# Altium project Thermostat.PrjPCB (part 1 of 4)
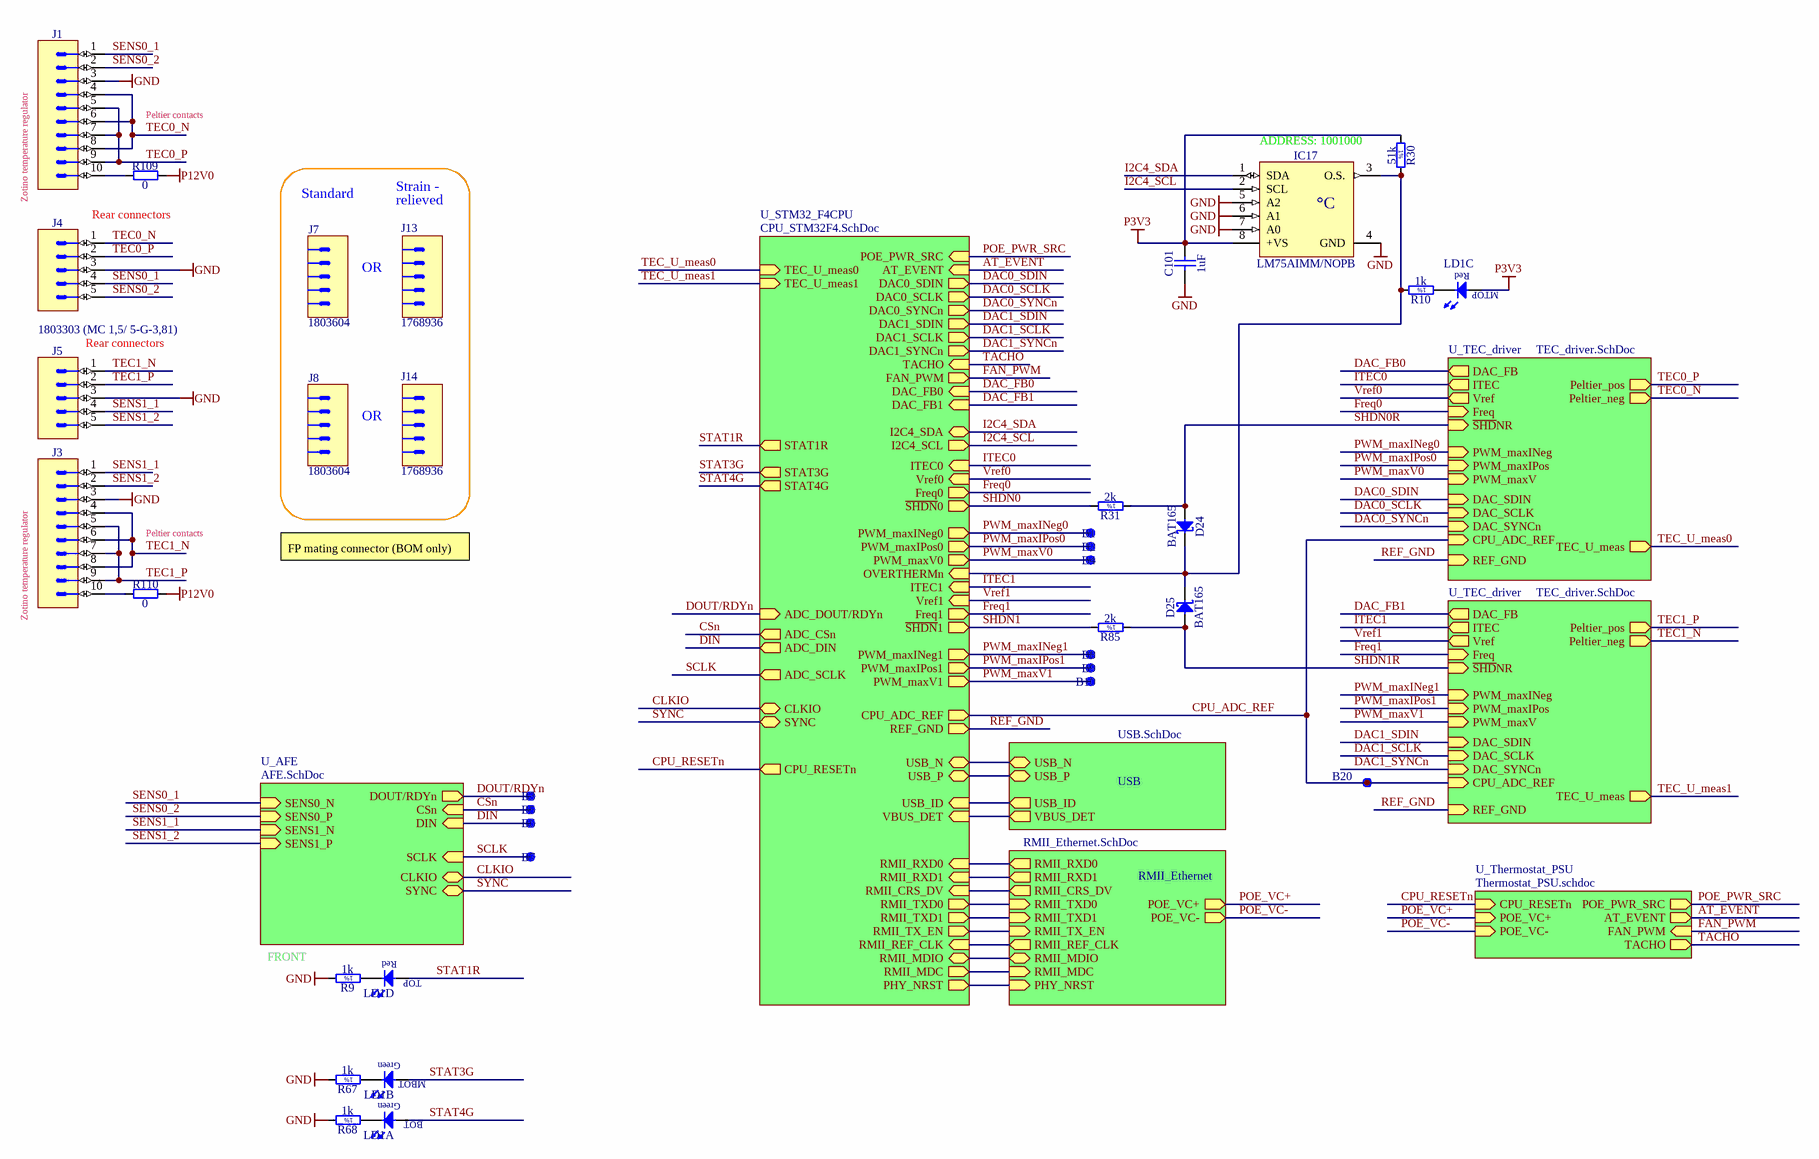
[diagram p0: Thermostat.schdoc]
P_version: 2.2.4
7 sheets, 417 parts. Net scope: hierarchical (ports join the sheet entries above them; power ports are global).
Board file: Thermostat.PCBDOC
Sheets:
  Thermostat.schdoc
    U_STM32_F4CPU = CPU_STM32F4.SchDoc
    U_AFE = AFE.SchDoc
    U_TEC_driver = TEC_driver.SchDoc
    U_TEC_driver = TEC_driver.SchDoc
    RMII_Ethernet = RMII_Ethernet.SchDoc
    USB = USB.SchDoc
    U_Thermostat_PSU = Thermostat_PSU.schdoc

## Sheet Thermostat.schdoc: Thermostat
size 420 x 297 mm; EDA_Number: ARTIQ; Projet: Thermostat; CheckedBy: -; Author: G.Kasprowicz; CompanyName: WUT ISE; DrawnBy: G.Kasprowicz; Organization: WUT ISE; Address1: PW ISE; Address2: Nowowiejska 15/19 00-665 Warsaw; Address3: gkasprow@gmail.com; DocumentNumber: 1; Revision: 2.2.4; SheetNumber: 1; SheetTotal: 6; ModifiedBy: -; CreateDate: -; CheckedDate: -; Title2: Top; DivGrp: WUT ISE; Designer: G.Kasprowicz; ModifiedDate: -; ProjectName: Sensor Box

### Parts
B1  SMD Pad  [C100]  (value not drawn)  (no BOM)
B2  SMD Pad  [C100]  (value not drawn)  (no BOM)
B3  SMD Pad  [C100]  (value not drawn)  (no BOM)
B4  SMD Pad  [C100]  (value not drawn)  (no BOM)
B5  SMD Pad  [C100]  (value not drawn)  (no BOM)
B6  SMD Pad  [C100]  (value not drawn)  (no BOM)
B7  SMD Pad  [C100]  (value not drawn)  (no BOM)
B8  SMD Pad  [C100]  (value not drawn)  (no BOM)
B9  SMD Pad  [C100]  (value not drawn)  (no BOM)
B10  SMD Pad  [C100]  (value not drawn)  (no BOM)
B20  SMD Pad  [C100]  (value not drawn)  (no BOM)
C101  1uF  [CAPC1608X87N]
D24  BAT165  [SOD2512X110N]
D25  BAT165  [SOD2512X110N]
IC17  LM75AIMM/NOPB  [SOP65P490X109-8N]
J1  Header 10  [3M_N2510-6002RB]  (value not drawn)
J3  Header 10  [3M_N2510-6002RB]  (value not drawn)
J4  PHOENIX_1803303  [PHOENIX_1803303]  (value not drawn)
J5  Manufacturer Part Number: 1803303 (MC 1,5/ 5-G-3,81)  [PHOENIX_1803303]  (hidden comment: PHOENIX_1803303)
J7  1803604  [PHOENIX_1803604]
J8  1803604  [PHOENIX_1803604]
J13  1768936  [PHOENIX_1768936]
J14  1768936  [PHOENIX_1768936]
LD1  Green/Green/HeRed/HeRed  [LED_BIVAR_H485CHHGGDL]  (value not drawn)  (parts A,B,C,D of 4)
R9  1k  [RESC1005X40N]
R10  1k  [RESC1005X40N]
R30  51k  [RESC1005X40N]
R31  2k  [RESC1005X40N]
R67  1k  [RESC1005X40N]
R68  1k  [RESC1005X40N]
R85  2k  [RESC1005X40N]
R109  0  [RESC1608X55N]
R110  0  [RESC1608X55N]

### Sub-sheets
RMII_Ethernet = RMII_Ethernet.SchDoc: RMII_TXD0 (in), RMII_TX_EN (in), RMII_RXD0 (out), RMII_REF_CLK (out), RMII_CRS_DV (out), RMII_MDC (in), RMII_MDIO (bidir), PHY_NRST (in), RMII_TXD1 (in), RMII_RXD1 (out), POE_VC+ (out), POE_VC- (out)
U_AFE = AFE.SchDoc: SCLK (in), DOUT/RDYn (out), SENS1_P (in), SENS1_N (in), SENS0_N (in), SENS0_P (in), CSn (in), DIN (in), CLKIO (bidir), SYNC (bidir)
U_STM32_F4CPU = CPU_STM32F4.SchDoc: STAT1R (out), OVERTHERMn (in), ITEC0 (in), Vref0 (in), Freq0 (out), ~{SHDN}0 (out), PWM_maxINeg0 (out), PWM_maxIPos0 (out), PWM_maxV0 (out), ITEC1 (in), Freq1 (out), ~{SHDN}1 (out), PWM_maxINeg1 (out), PWM_maxIPos1 (out), PWM_maxV1 (out), Vref1 (in), ADC_SCLK (out), ADC_DOUT/RDYn (in), ADC_CSn (out), ADC_DIN (out), USB_ID (in), RMII_RXD0 (in), USB_N (bidir), USB_P (bidir), RMII_TXD0 (out), RMII_RXD1 (in), RMII_MDC (out), RMII_TXD1 (out), RMII_TX_EN (out), RMII_CRS_DV (in), RMII_REF_CLK (in), RMII_MDIO (bidir), DAC0_SDIN (out), DAC0_SCLK (out), DAC0_SYNCn (out), DAC1_SDIN (out), DAC1_SCLK (out), DAC1_SYNCn (out), DAC_FB0 (in), DAC_FB1 (in), AT_EVENT (in), STAT3G (out), STAT4G (out), CLKIO (bidir), SYNC (bidir), TEC_U_meas0 (in), TEC_U_meas1 (in), CPU_RESETn (out), PHY_NRST (out), I2C4_SDA (bidir), I2C4_SCL (out), TACHO (in), CPU_ADC_REF (out), POE_PWR_SRC (in), REF_GND (out), FAN_PWM (out), VBUS_DET (in)
U_TEC_driver = TEC_driver.SchDoc: Peltier_pos (out), Peltier_neg (out), Freq (in), ~{SHD}NR (in), ITEC (out), Vref (out), PWM_maxINeg (in), PWM_maxIPos (in), PWM_maxV (in), DAC_SDIN (in), DAC_SYNCn (in), DAC_SCLK (in), DAC_FB (out), TEC_U_meas (out), REF_GND (in), CPU_ADC_REF (in)
U_TEC_driver = TEC_driver.SchDoc: Peltier_pos (out), Peltier_neg (out), Freq (in), ~{SHD}NR (in), ITEC (out), Vref (out), PWM_maxINeg (in), PWM_maxIPos (in), PWM_maxV (in), DAC_SDIN (in), DAC_SYNCn (in), DAC_SCLK (in), DAC_FB (out), TEC_U_meas (out), REF_GND (in), CPU_ADC_REF (in)
U_Thermostat_PSU = Thermostat_PSU.schdoc: CPU_RESETn (in), POE_VC+ (in), POE_VC- (in), POE_PWR_SRC (out), AT_EVENT (out), TACHO (out), FAN_PWM (in)
USB = USB.SchDoc: VBUS_DET (out), USB_N (bidir), USB_P (bidir), USB_ID (out)

### Nets
GND: C101.1 IC17.4(GND) IC17.5(A2) IC17.6(A1) IC17.7(A0) J1.3 J3.3 J4.3 J5.3 R9.2 R67.2 R68.2
P3V3: C101.2 IC17.8(+VS) LD1.6(A) R30.1
P12V0: R109.2 R110.2
~{SHDN}0: R31.2 ; sheet U_STM32_F4CPU/~{SHDN}0
~{SHDN}0R: D24.2(A) R31.1 ; sheet U_TEC_driver/~{SHD}NR
~{SHDN}1: R85.2 ; sheet U_STM32_F4CPU/~{SHDN}1
~{SHDN}1R: D25.2(A) R85.1 ; sheet U_TEC_driver/~{SHD}NR
AT_EVENT: sheet U_STM32_F4CPU/AT_EVENT, sheet U_Thermostat_PSU/AT_EVENT
CLKIO: sheet U_STM32_F4CPU/CLKIO, sheet U_AFE/CLKIO
CPU_ADC_REF: B20.1 ; sheet U_STM32_F4CPU/CPU_ADC_REF, sheet U_TEC_driver/CPU_ADC_REF, sheet U_TEC_driver/CPU_ADC_REF
CPU_RESETn: sheet U_STM32_F4CPU/CPU_RESETn, sheet U_Thermostat_PSU/CPU_RESETn
CSn: B5.1 ; sheet U_STM32_F4CPU/ADC_CSn, sheet U_AFE/CSn  [project net ADC_CSn]
DAC0_SCLK: sheet U_STM32_F4CPU/DAC0_SCLK, sheet U_TEC_driver/DAC_SCLK
DAC0_SDIN: sheet U_STM32_F4CPU/DAC0_SDIN, sheet U_TEC_driver/DAC_SDIN
DAC0_SYNCn: sheet U_STM32_F4CPU/DAC0_SYNCn, sheet U_TEC_driver/DAC_SYNCn
DAC1_SCLK: sheet U_STM32_F4CPU/DAC1_SCLK, sheet U_TEC_driver/DAC_SCLK
DAC1_SDIN: sheet U_STM32_F4CPU/DAC1_SDIN, sheet U_TEC_driver/DAC_SDIN
DAC1_SYNCn: sheet U_STM32_F4CPU/DAC1_SYNCn, sheet U_TEC_driver/DAC_SYNCn
DAC_FB0: sheet U_STM32_F4CPU/DAC_FB0, sheet U_TEC_driver/DAC_FB
DAC_FB1: sheet U_STM32_F4CPU/DAC_FB1, sheet U_TEC_driver/DAC_FB
DIN: B6.1 ; sheet U_STM32_F4CPU/ADC_DIN, sheet U_AFE/DIN  [project net ADC_DIN]
DOUT/RDYn: B3.1 ; sheet U_STM32_F4CPU/ADC_DOUT/RDYn, sheet U_AFE/DOUT/RDYn  [project net ADC_DOUT/RDYn]
FAN_PWM: sheet U_STM32_F4CPU/FAN_PWM, sheet U_Thermostat_PSU/FAN_PWM
Freq0: sheet U_STM32_F4CPU/Freq0, sheet U_TEC_driver/Freq
Freq1: sheet U_STM32_F4CPU/Freq1, sheet U_TEC_driver/Freq
I2C4_SCL: IC17.2(SCL) ; sheet U_STM32_F4CPU/I2C4_SCL
I2C4_SDA: IC17.1(SDA) ; sheet U_STM32_F4CPU/I2C4_SDA
ITEC0: sheet U_STM32_F4CPU/ITEC0, sheet U_TEC_driver/ITEC
ITEC1: sheet U_STM32_F4CPU/ITEC1, sheet U_TEC_driver/ITEC
NRST: sheet U_STM32_F4CPU/PHY_NRST, sheet RMII_Ethernet/PHY_NRST
OVERTHERMn: D24.1(C) D25.1(C) IC17.3(O.S.) R10.2 R30.2 ; sheet U_STM32_F4CPU/OVERTHERMn
POE_PWR_SRC: sheet U_STM32_F4CPU/POE_PWR_SRC, sheet U_Thermostat_PSU/POE_PWR_SRC
POE_VC+: sheet RMII_Ethernet/POE_VC+, sheet U_Thermostat_PSU/POE_VC+
POE_VC-: sheet RMII_Ethernet/POE_VC-, sheet U_Thermostat_PSU/POE_VC-
PWM_maxINeg0: B1.1 ; sheet U_STM32_F4CPU/PWM_maxINeg0, sheet U_TEC_driver/PWM_maxINeg
PWM_maxINeg1: B8.1 ; sheet U_STM32_F4CPU/PWM_maxINeg1, sheet U_TEC_driver/PWM_maxINeg
PWM_maxIPos0: B2.1 ; sheet U_STM32_F4CPU/PWM_maxIPos0, sheet U_TEC_driver/PWM_maxIPos
PWM_maxIPos1: B9.1 ; sheet U_STM32_F4CPU/PWM_maxIPos1, sheet U_TEC_driver/PWM_maxIPos
PWM_maxV0: B4.1 ; sheet U_STM32_F4CPU/PWM_maxV0, sheet U_TEC_driver/PWM_maxV
PWM_maxV1: B10.1 ; sheet U_STM32_F4CPU/PWM_maxV1, sheet U_TEC_driver/PWM_maxV
REF_GND: sheet U_STM32_F4CPU/REF_GND, sheet U_TEC_driver/REF_GND, sheet U_TEC_driver/REF_GND
RMII_CRS_DV: sheet U_STM32_F4CPU/RMII_CRS_DV, sheet RMII_Ethernet/RMII_CRS_DV
RMII_MDC: sheet U_STM32_F4CPU/RMII_MDC, sheet RMII_Ethernet/RMII_MDC
RMII_MDIO: sheet U_STM32_F4CPU/RMII_MDIO, sheet RMII_Ethernet/RMII_MDIO
RMII_REF_CLK: sheet U_STM32_F4CPU/RMII_REF_CLK, sheet RMII_Ethernet/RMII_REF_CLK
RMII_RXD0: sheet U_STM32_F4CPU/RMII_RXD0, sheet RMII_Ethernet/RMII_RXD0
RMII_RXD1: sheet U_STM32_F4CPU/RMII_RXD1, sheet RMII_Ethernet/RMII_RXD1
RMII_TX_EN: sheet U_STM32_F4CPU/RMII_TX_EN, sheet RMII_Ethernet/RMII_TX_EN
RMII_TXD0: sheet U_STM32_F4CPU/RMII_TXD0, sheet RMII_Ethernet/RMII_TXD0
RMII_TXD1: sheet U_STM32_F4CPU/RMII_TXD1, sheet RMII_Ethernet/RMII_TXD1
SCLK: B7.1 ; sheet U_STM32_F4CPU/ADC_SCLK, sheet U_AFE/SCLK  [project net ADC_SCLK]
SENS0_1: J1.1 J4.4 ; sheet U_AFE/SENS0_N
SENS0_2: J1.2 J4.5 ; sheet U_AFE/SENS0_P
SENS1_1: J3.1 J5.4 ; sheet U_AFE/SENS1_N
SENS1_2: J3.2 J5.5 ; sheet U_AFE/SENS1_P
STAT1R: LD1.8(A) ; sheet U_STM32_F4CPU/STAT1R
STAT3G: LD1.4(A) ; sheet U_STM32_F4CPU/STAT3G
STAT4G: LD1.2(A) ; sheet U_STM32_F4CPU/STAT4G
SYNC: sheet U_STM32_F4CPU/SYNC, sheet U_AFE/SYNC
TACHO: sheet U_STM32_F4CPU/TACHO, sheet U_Thermostat_PSU/TACHO
TEC0_N: J1.4 J1.6 J1.8 J4.1 ; sheet U_TEC_driver/Peltier_neg
TEC0_P: J1.5 J1.7 J1.9 J4.2 ; sheet U_TEC_driver/Peltier_pos
TEC1_N: J3.4 J3.6 J3.8 J5.1 ; sheet U_TEC_driver/Peltier_neg
TEC1_P: J3.5 J3.7 J3.9 J5.2 ; sheet U_TEC_driver/Peltier_pos
TEC_U_meas0: sheet U_STM32_F4CPU/TEC_U_meas0, sheet U_TEC_driver/TEC_U_meas  [project net ADC3_IN12]
TEC_U_meas1: sheet U_STM32_F4CPU/TEC_U_meas1, sheet U_TEC_driver/TEC_U_meas  [project net ADC3_IN13]
USB_ID: sheet U_STM32_F4CPU/USB_ID, sheet USB/USB_ID
USB_N: sheet U_STM32_F4CPU/USB_N, sheet USB/USB_N
USB_P: sheet U_STM32_F4CPU/USB_P, sheet USB/USB_P
USB_VBUS: sheet U_STM32_F4CPU/VBUS_DET, sheet USB/VBUS_DET
Vref0: sheet U_STM32_F4CPU/Vref0, sheet U_TEC_driver/Vref
Vref1: sheet U_STM32_F4CPU/Vref1, sheet U_TEC_driver/Vref
NetJ1_10: J1.10 R109.1
NetJ3_10: J3.10 R110.1
NetLD1_1: LD1.1(C) R68.1
NetLD1_3: LD1.3(C) R67.1
NetLD1_5: LD1.5(C) R10.1
NetLD1_7: LD1.7(C) R9.1

### Notes on the sheet
- Peltier contacts
- (near J13) Strain -
- ADDRESS: 1001000
- Zotino temperature regulator
- Rear connectors
- Standard
- (near J13) relieved
- (near J13) OR
- (near J5) Rear connectors
- (near J14) OR
- FP mating connector (BOM only)
- (near J3) Zotino temperature regulator
- (near R9) FRONT
- Project/Equipment
- Document
- Designer
- Drawn by
- Check.by
- Copyright WUT ISE 2020.
  This documentation describes Open Hardware and is licensed under the CERN OHL v.1.2. You may redistribute and modify this documentation under the terms of the CERN OHL v.1.2. (http://ohwr.org/CERNOHL). This documentation is distributed WITHOUT ANY EXPRESS OR IMPLIED WARRANTY, INCLUDING OF MERCHANTABILITY, SATISFACTORY QUALITY AND FITNESS FOR A PARTICULAR PURPOSE. Please see the CERN OHL v.1.2 for applicable conditions.
- Contact
- File
- Last Mod.
- Print Date
- Sheet
- Size
- A3
- of
- Rev
- (in symbol LED_BIVAR_H485CHHGGDL, part A) Green; BOT
- (in symbol LED_BIVAR_H485CHHGGDL, part B) Green; MBOT
- (in symbol LED_BIVAR_H485CHHGGDL, part C) Red; MTOP
- (in symbol LED_BIVAR_H485CHHGGDL, part D) Red; TOP
- (in symbol LM75AIMM/NOPB) °C
- (in symbol R0402_1K_1%_0.0625W_100PPM) 1%
- (in symbol R0402_2K_1%_0.0625W_100PPM) 1%
- (in symbol R0402_51K_1%_0.0625W_100PPM) 1%

### Library data of the parts
B1-B10 B20 = SMD_PAD_D1MM: Through Hole Pad; Part Description: 1mm Diameter SMD Pad; Mounted: No; Part Number: SMD_PAD_D1MM; Component Type: Standard (No BOM); Pin Count: 1; Family: SMD Pad; Socket: No; SMD: No; Sense: No; Status: None; ComponentHeight: 0mm; HelpURL: Undefined; Author: CERN DEM JLC; CreateDate: 10.10.2017; LatestRevisionDate: 10.10.2017; PackageDescription: 1mm Diameter SMD Pad
C101 = CC0603_1UF_25V_10%_X7R: Non-polarised capacitor; Part Description: SMD Multilayer Chip Ceramic Capacitor; Manufacturer: GENERIC; Manufacturer1 Part Number: GRM188R71E105KA12D; Voltage: 25V; TC: X7R; Tolerance: ±10%; Part Number: CC0603_1UF_25V_10%_X7R; Component Kind: Standard; Component Type: Standard; Pin Count: 2; Value: 1uF; Status: None; Manufacturer Part Number: CC0603_1UF_25V_10%_X7R; Case: 0603; Mounted: Yes; Socket: No; SMD: Yes; Sense: No; Manufacturer1 Example: MURATA; Manufacturer1 ComponentHeight: 0.9mm; HelpURL: \\cern.ch\dfs\Applications\Altium\Datasheets\CC0603_X7R_MURATA.pdf; Author: CERN DEM JLC; CreateDate: 18/01/2011; LatestRevisionDate: 18/01/2011
D24 D25 = BAT165: Schottky Diode; Part Description: Medium Power AF Schottky Diode; Manufacturer: INFINEON; Voltage: 40V; Power: 750mA; PressFit: No; Bonding: No; Part Number: BAT165; Component Kind: Standard; Component Type: Standard; Device: BAT165; PackageDescription: Small Outline Diode Flat Lead (SOD-323), 1.70mm W X 1.25mm L X 1.10mm H body,  IPC Medium Density; Manufacturer Part Number: BAT165; Pin Count: 2; Case: SOD323; Mounted: Yes; Socket: No; SMD: Yes; Sense: No; ComponentHeight: 1.1mm; HelpURL: \\cern.ch\dfs\Applications\Altium\Datasheets\BAT165.pdf; Author: CERN DEM JLC; CreateDate: 12.11.2014; LatestRevisionDate: 12.11.2014
IC17 = LM75AIMM/NOPB: Digital Temperature Sensor and Thermal Watchdog with Two-Wire Interface; Part Description: -25° to +100°C ±2°C Digital Temperature Sensor and Thermal Watchdog with Two-Wire Interface; Manufacturer: TEXAS INSTRUMENTS; PressFit: No; Bonding: No; Part Number: LM75AIMM/NOPB; Component Kind: Standard; Component Type: Standard; Device: LM75AIMM/NOPB; PackageDescription: SOP, 0.65mm pitch; 8 pin,3.00mm W X 3.00mm L X 1.09mm H bodyI, PC Medium Density; Manufacturer Part Number: LM75AIMM/NOPB; Pin Count: 8; Case: SSOP8; Mounted: Yes; Socket: No; SMD: Yes; Sense: No; ComponentHeight: 1.09mm; HelpURL: \\cern.ch\dfs\Applications\Altium\Datasheets\LM75AIMM-NOPB.pdf; Author: CERN DEM JLC; CreateDate: 15.10.2012; LatestRevisionDate: 15.10.2012
J1 J3 = 3M_N2510-6002RB: Connector 10 Male; Part Description: 10 Contacts - Straight .100'' x .100'' Low Profile Four-Wall Header, 2500 Series; Manufacturer: 3M; PressFit: No; Part Number: 3M_N2510-6002RB; Component Kind: Standard; Component Type: Standard; Pin Count: 10; Family: Header 10; Mounted: Yes; Socket: No; SMD: No; Sense: No; Status: None; Manufacturer Part Number: N2510-6002RB; ComponentHeight: 10.03mm; HelpURL: \\cern.ch\dfs\Applications\Altium\Datasheets\3M_N2510-6002RB.pdf; Author: CERN DEM JLC; CreateDate: 11.02.2009; LatestRevisionDate: 11.08.2009
J4 = PHOENIX_1803303: Connector 5 Male; Part Description: 8A 160 V, Pitch: 3.81mm, 5 Positions  Right Angled Header; Manufacturer: PHOENIX CONTACT; Manufacturer Part Number: 1803303 (MC 1,5/ 5-G-3,81); PressFit: No; Part Number: PHOENIX_1803303; Component Kind: Standard; Component Type: Standard; Pin Count: 5; Mounted: Yes; Socket: No; SMD: No; Sense: No; Status: None; ComponentHeight: 7.25mm; HelpURL: \\cern.ch\dfs\Applications\Altium\Datasheets\PHOENIX_1803303.pdf; Author: CERN DEM JLC; CreateDate: 11/06/2013; LatestRevisionDate: 11/06/2013
J5 = PHOENIX_1803303: Connector 5 Male; Part Description: 8A 160 V, Pitch: 3.81mm, 5 Positions  Right Angled Header; Manufacturer: PHOENIX CONTACT; PressFit: No; Part Number: PHOENIX_1803303; Component Kind: Standard; Component Type: Standard; Pin Count: 5; Mounted: Yes; Socket: No; SMD: No; Sense: No; Status: None; ComponentHeight: 7.25mm; HelpURL: \\cern.ch\dfs\Applications\Altium\Datasheets\PHOENIX_1803303.pdf; Author: CERN DEM JLC; CreateDate: 11/06/2013; LatestRevisionDate: 11/06/2013
J7 J8 = PHOENIX_1803604: Phoenix Contact 3.81 pitch terminal plug, 5 ways; Mates with: PHOENIX_1803303; Manufacturer: Phoenix Contact; Manufacturer Part Number: 1803604
J13 J14 = PHOENIX_1768936: PHOENIX TB connector MC 1,5/ 5-STZ2-3,81 -; Manufacturer: Phoenix Contact; Mates with: PHOENIX_1803303; Manufacturer Part Number: 1768936
LD1 = LED_BIVAR_H485CHHGGDL: LED x4 G-1C2A-BOT_G-3C4A_H-5C6A_H-7C8A-TOP; Part Description: Quad-Level 2mm (Green+Green+HeRed+HeRed) LED, PCB Edge Mounting; Manufacturer: BIVAR; PressFit: No; Bonding: No; Part Number: LED_BIVAR_H485CHHGGDL; Component Kind: Standard; Component Type: Standard; Color: Green/Green/HeRed/HeRed; PackageDescription: Quad-Level 2mm (Green+Green+HeRed+HeRed) LED, PCB Edge Mounting  BIVAR H485C Serie; Status: Not Recommended; Manufacturer Part Number: H485CHHGGDL; Pin Count: 8; Mounted: Yes; Socket: No; SMD: No; Sense: No; ComponentHeight: 11.3mm; HelpURL: \\cern.ch\dfs\Applications\Altium\Datasheets\LED_BIVAR_H485C.pdf; Author: CERN DEM BC; CreateDate: 12.11.2015; LatestRevisionDate: 12.11.2015
R9 R10 R67 R68 = R0402_1K_1%_0.0625W_100PPM: Resistor - 1%; Part Description: General Purpose Thick Film Chip Resistor; Manufacturer: GENERIC; Manufacturer1 Part Number: 232270671002L; TC: ±100ppm/°C; PressFit: No; Part Number: R0402_1K_1%_0.0625W_100PPM; Component Kind: Standard; Component Type: Standard; Pin Count: 2; Value: 1k; Status: Not Recommended; Power: 0.0625W; Tolerance: ±1%; Manufacturer Part Number: R0402_1K_1%_0.0625W_100PPM; Case: 0402; Mounted: Yes; Sense: No; Socket: No; SMD: Yes; Manufacturer1 Example: YAGEO PHYCOMP; Manufacturer1 ComponentHeight: 0.4mm; HelpURL: \\cern.ch\dfs\Applications\Altium\Datasheets\R0402_Phycomp_RC0402.pdf; Author: CERN DEM JLC; CreateDate: 03.12.2007; LatestRevisionDate: 17.10.2012
R30 = R0402_51K_1%_0.0625W_100PPM: Resistor - 1%; Part Description: General Purpose Thick Film Chip Resistor; Manufacturer: GENERIC; Manufacturer1 Part Number: 232270674703L; TC: ±100ppm/°C; PressFit: No; Part Number: R0402_51K_1%_0.0625W_100PPM; Component Kind: Standard; Component Type: Standard; Pin Count: 2; Value: 51k; Status: Not Recommended; Power: 0.0625W; Tolerance: ±1%; Manufacturer Part Number: R0402_51K_1%_0.0625W_100PPM; Case: 0402; Mounted: Yes; Sense: No; Socket: No; SMD: Yes; Manufacturer1 Example: YAGEO PHYCOMP; Manufacturer1 ComponentHeight: 0.4mm; HelpURL: \\cern.ch\dfs\Applications\Altium\Datasheets\R0402_Phycomp_RC0402.pdf; Author: CERN DEM JLC; CreateDate: 03.12.2007; LatestRevisionDate: 17.10.2012
R31 R85 = R0402_2K_1%_0.0625W_100PPM: Resistor - 1%; Part Description: General Purpose Thick Film Chip Resistor; Manufacturer: GENERIC; Manufacturer1 Part Number: 232270672002L; TC: ±100ppm/°C; PressFit: No; Part Number: R0402_2K_1%_0.0625W_100PPM; Component Kind: Standard; Component Type: Standard; Pin Count: 2; Value: 2k; Status: Not Recommended; Power: 0.0625W; Tolerance: ±1%; Manufacturer Part Number: R0402_2K_1%_0.0625W_100PPM; Case: 0402; Mounted: Yes; Sense: No; Socket: No; SMD: Yes; Manufacturer1 Example: YAGEO PHYCOMP; Manufacturer1 ComponentHeight: 0.4mm; HelpURL: \\cern.ch\dfs\Applications\Altium\Datasheets\R0402_Phycomp_RC0402.pdf; Author: CERN DEM JLC; CreateDate: 03.12.2007; LatestRevisionDate: 17.10.2012
R109 R110 = R0603_0R_JUMPER: Resistor; Part Description: 1A (0.05R Max DC Resistance) Zero Ohm Jumper; Manufacturer: GENERIC; Manufacturer1 Part Number: NRC06Z0; PressFit: No; Part Number: R0603_0R_JUMPER; Component Kind: Standard; Component Type: Standard; Pin Count: 2; Value: 0; Status: Preferred; Manufacturer Part Number: R0603_0R_JUMPER; Case: 0603; Mounted: Yes; Sense: No; Socket: No; SMD: Yes; Manufacturer1 Example: NIC COMPONENT; Manufacturer1 ComponentHeight: 0.55mm; HelpURL: \\cern.ch\dfs\Applications\Altium\Datasheets\R0603_NIC_NRC.pdf; Author: CERN DEM JLC; CreateDate: 03.12.2007; LatestRevisionDate: 13.03.2008

## Sheet CPU_STM32F4.SchDoc: STM32 CPU
size 420 x 297 mm; CheckedBy: -; Author: G. Kasprowicz; CompanyName: WUT; DrawnBy: G. Kasprowicz; Organization: WUT ISE; Address1: Warsaw Univeristy of Technology; Address2: Nowowiejska 15/19; Address3: gkasprow@gmail.com; DocumentNumber: 6; Revision: 2.2.4; SheetNumber: 6; SheetTotal: 6; EDA_Number: ARTIQ; Projet: Thermostat; ModifiedBy: -; CreateDate: -; CheckedDate: -; DivGrp: ISE; Designer: G. Kasprowicz; ModifiedDate: -; ProjectName: Booster RF Power Amplifier
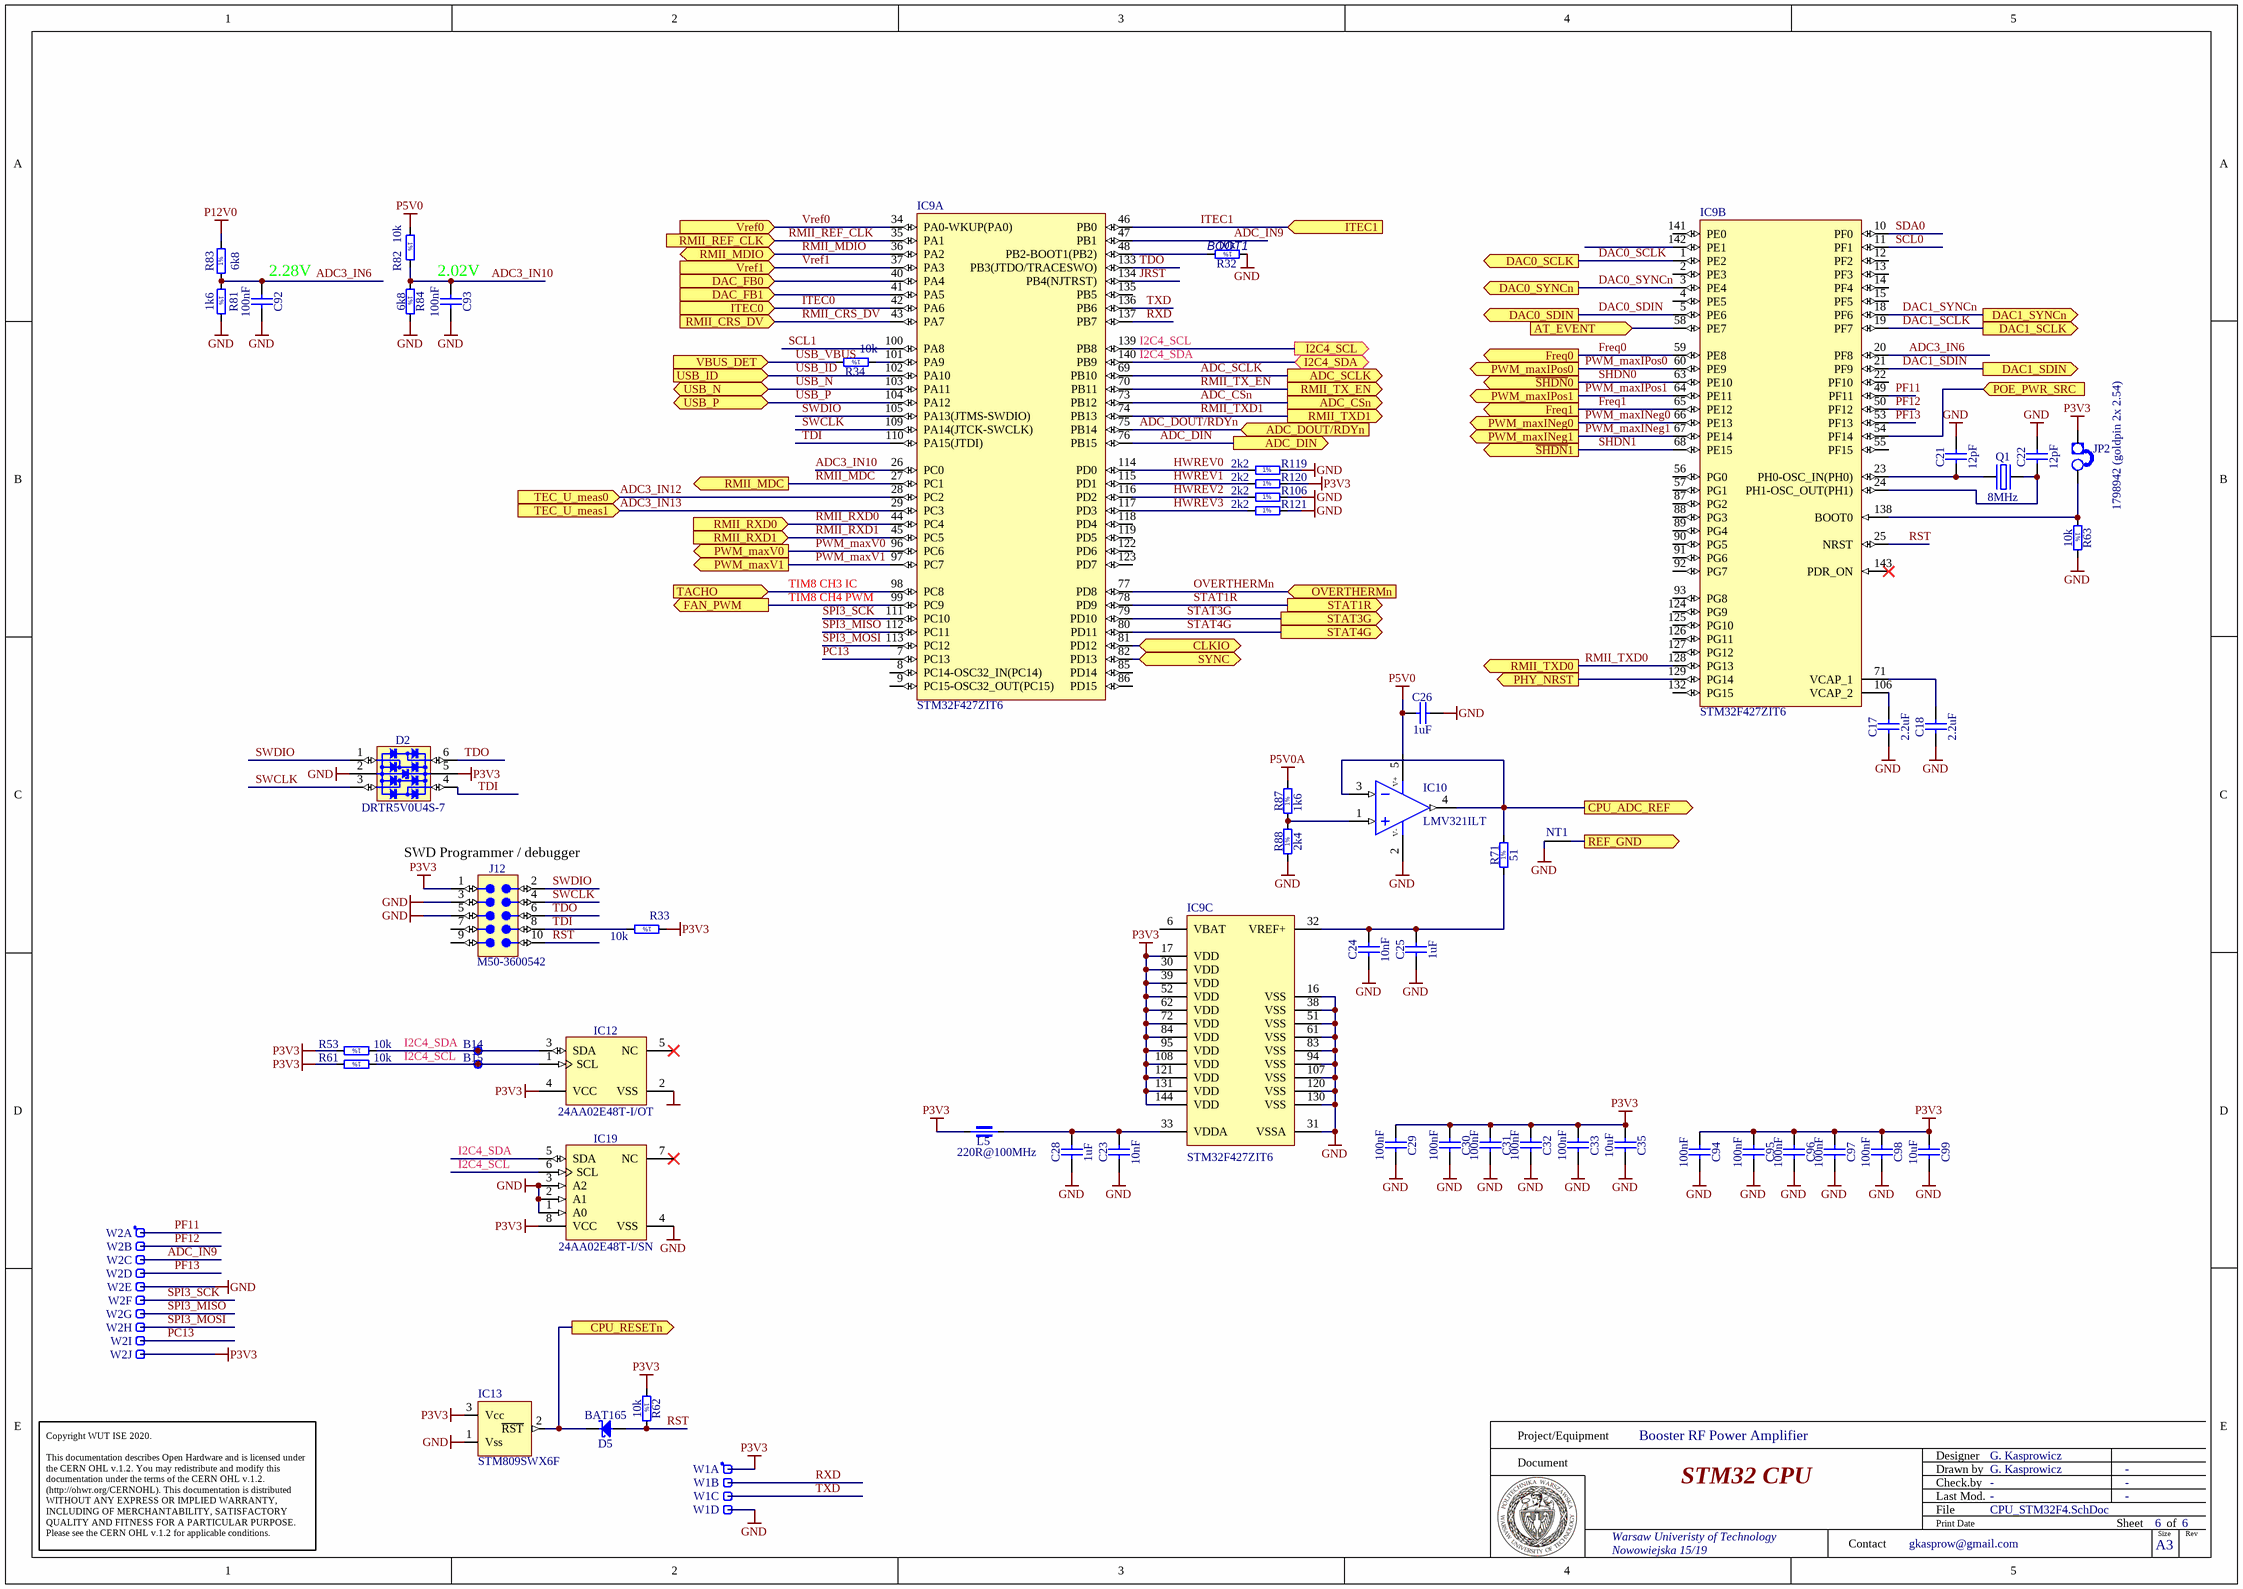
[diagram p1: CPU_STM32F4.SchDoc]

### Parts
B14  SMD Pad  [C100]  (value not drawn)  (no BOM)
B15  SMD Pad  [C100]  (value not drawn)  (no BOM)
C17  2.2uF  [CAPC1608X90N]
C18  2.2uF  [CAPC1608X90N]
C21  12pF  [CAPC1005X55N]
C22  12pF  [CAPC1005X55N]
C23  10nF  [CAPC1005X55N]
C24  10nF  [CAPC1005X55N]
C25  1uF  [CAPC1608X87N]
C26  1uF  [CAPC1608X87N]
C28  1uF  [CAPC1608X87N]
C29  100nF  [CAPC1005X55N]
C30  100nF  [CAPC1005X55N]
C31  100nF  [CAPC1005X55N]
C32  100nF  [CAPC1005X55N]
C33  100nF  [CAPC1005X55N]
C35  10uF  [CAPC2012X135N]
C92  100nF  [CAPC1005X55N]
C93  100nF  [CAPC1005X55N]
C94  100nF  [CAPC1005X55N]
C95  100nF  [CAPC1005X55N]
C96  100nF  [CAPC1005X55N]
C97  100nF  [CAPC1005X55N]
C98  100nF  [CAPC1005X55N]
C99  10uF  [CAPC2012X135N]
D2  DRTR5V0U4S-7  [SOT65P210X110-6N]
D5  BAT165  [SOD2512X110N]
IC9  STM32F427ZIT6  [STM-LQFP144_V]  (parts A,B,C of 3)
IC10  LMV321ILT  [SOT95P280X145-5N]
IC12  24AA02E48T-I/OT  [SOT95P280X145-5N]
IC13  STM809SWX6F  [SOT-23]
IC19  24AA02E48T-I/SN  [SOIC127P600X175-8N]
J12  Manufacturer Part Number: M50-3600542  [HARWIN_M50-3600542]  (hidden comment: Header 10)
JP2  1798942 (goldpin 2x 2.54)  [jump]
L5  220R@100MHz  [INDC1005X55N]
NT1  Net Tie  [Net Tie]  (value not drawn)  (net tie, no BOM)
Q1  8MHz  [XTAL_TXC_7A]
R32  10k  [RESC1005X40N]
R33  10k  [RESC1005X40N]
R34  10k  [RESC1005X40N]
R53  10k  [RESC1005X40N]
R61  10k  [RESC1005X40N]
R62  10k  [RESC1005X40N]
R63  10k  [RESC1005X40N]
R71  51  [RESC1005X40N]
R81  1k6  [RESC1005X40N]
R82  10k  [RESC1005X40N]
R83  6k8  [RESC1005X40N]
R84  6k8  [RESC1005X40N]
R87  1k6  [RESC1005X40N]
R88  2k4  [RESC1005X40N]
R106  2k2  [RESC1005X40N]
R119  2k2  [RESC1005X40N]
R120  2k2  [RESC1005X40N]
R121  2k2  [RESC1005X40N]
W1  Header 4  [SAMTEC_HTSW-104-23-L-S]  (value not drawn)  (parts A,B,C,D of 4)
W2  Header 10  [SAMTEC_MTLW-110-07-L-S-250]  (value not drawn)  (parts A,B,C,D,E,F,G,H,I,J of 10)

### Ports
ADC_CSn (out), ADC_DIN (out), ADC_DOUT/RDYn (in), ADC_SCLK (out), AT_EVENT (in), CLKIO (bidir), CPU_ADC_REF (out), CPU_RESETn (out), DAC0_SCLK (out), DAC0_SDIN (out), DAC0_SYNCn (out), DAC1_SCLK (out), DAC1_SDIN (out), DAC1_SYNCn (out), DAC_FB0 (in), DAC_FB1 (in), FAN_PWM (out), Freq0 (out), Freq1 (out), I2C4_SCL (out), I2C4_SDA (bidir), ITEC0 (in), ITEC1 (in), OVERTHERMn (in), PHY_NRST (out), POE_PWR_SRC (in), PWM_maxINeg0 (out), PWM_maxINeg1 (out), PWM_maxIPos0 (out), PWM_maxIPos1 (out), PWM_maxV0 (out), PWM_maxV1 (out), REF_GND (out), RMII_CRS_DV (in), RMII_MDC (out), RMII_MDIO (bidir), RMII_REF_CLK (in), RMII_RXD0 (in), RMII_RXD1 (in), RMII_TX_EN (out), RMII_TXD0 (out), RMII_TXD1 (out), STAT1R (out), STAT3G (out), STAT4G (out), SYNC (bidir), TACHO (in), TEC_U_meas0 (in), TEC_U_meas1 (in), USB_ID (in), USB_N (bidir), USB_P (bidir), VBUS_DET (in), Vref0 (in), Vref1 (in), ~{SHDN}0 (out), ~{SHDN}1 (out)

### Nets
GND: C17.1 C18.1 C21.2 C22.2 C23.1 C24.1 C25.1 C26.2 C28.1 C29.2 C30.2 C31.2 C32.2 C33.2 C35.2 C92.2 C93.2 C94.2 C95.2 C96.2 C97.2 C98.2 C99.2 D2.2(GND) IC9.16(VSS) IC9.31(VSSA) IC9.38(VSS) IC9.51(VSS) IC9.61(VSS) IC9.83(VSS) IC9.94(VSS) IC9.107(VSS) IC9.120(VSS) IC9.130(VSS) IC10.2(V-) IC12.2(VSS) IC13.1(Vss) IC19.1(A0) IC19.2(A1) IC19.3(A2) IC19.4(VSS) J12.3 J12.5 NT1.1 R32.1 R63.2 R81.2 R84.2 R88.1 R106.2 R119.2 R121.2 W1.4 W2.5
P3V3: C29.1 C30.1 C31.1 C32.1 C33.1 C35.1 C94.1 C95.1 C96.1 C97.1 C98.1 C99.1 D2.5(VBUS) IC9.17(VDD) IC9.30(VDD) IC9.39(VDD) IC9.52(VDD) IC9.62(VDD) IC9.72(VDD) IC9.84(VDD) IC9.95(VDD) IC9.108(VDD) IC9.121(VDD) IC9.131(VDD) IC9.144(VDD) IC12.4(VCC) IC13.3(Vcc) IC19.8(VCC) J12.1 JP2.1(E1) L5.2 R33.1 R53.2 R61.2 R62.1 R120.2 W1.1 W2.10
P5V0: C26.1 IC10.5(V+) R82.1
P5V0A: R87.2
P12V0: R83.2
~{SHDN}0: IC9.63(PE10) ; port ~{SHDN}0
~{SHDN}1: IC9.68(PE15) ; port ~{SHDN}1
ADC3_IN6: C92.1 IC9.20(PF8) R81.1 R83.1
ADC3_IN10: C93.1 IC9.26(PC0) R82.2 R84.1
ADC3_IN12: IC9.28(PC2) ; port TEC_U_meas0
ADC3_IN13: IC9.29(PC3) ; port TEC_U_meas1
ADC_CSn: IC9.73(PB12) ; port ADC_CSn
ADC_DIN: IC9.76(PB15) ; port ADC_DIN
ADC_DOUT/RDYn: IC9.75(PB14) ; port ADC_DOUT/RDYn
ADC_IN9: IC9.47(PB1) W2.3
ADC_SCLK: IC9.69(PB10) ; port ADC_SCLK
AT_EVENT: IC9.58(PE7) ; port AT_EVENT
CLKIO: IC9.81(PD12) ; port CLKIO
CPU_ADC_REF: IC10.3(IN-) IC10.4(OUT) R71.2 ; port CPU_ADC_REF
CPU_RESETn: D5.1(C) IC13.2(~{RST}) ; port CPU_RESETn
DAC0_SCLK: IC9.1(PE2) ; port DAC0_SCLK
DAC0_SDIN: IC9.5(PE6) ; port DAC0_SDIN
DAC0_SYNCn: IC9.3(PE4) ; port DAC0_SYNCn
DAC1_SCLK: IC9.19(PF7) ; port DAC1_SCLK
DAC1_SDIN: IC9.21(PF9) ; port DAC1_SDIN
DAC1_SYNCn: IC9.18(PF6) ; port DAC1_SYNCn
DAC_FB0: IC9.40(PA4) ; port DAC_FB0
DAC_FB1: IC9.41(PA5) ; port DAC_FB1
FAN_PWM: IC9.99(PC9) ; port FAN_PWM
Freq0: IC9.59(PE8) ; port Freq0
Freq1: IC9.65(PE12) ; port Freq1
HWREV0: IC9.114(PD0) R119.1
HWREV1: IC9.115(PD1) R120.1
HWREV2: IC9.116(PD2) R106.1
HWREV3: IC9.117(PD3) R121.1
I2C4_SCL: B15.1 IC9.139(PB8) IC12.1(SCL) IC19.6(SCL) R61.1 ; port I2C4_SCL
I2C4_SDA: B14.1 IC9.140(PB9) IC12.3(SDA) IC19.5(SDA) R53.1 ; port I2C4_SDA
ITEC0: IC9.42(PA6) ; port ITEC0
ITEC1: IC9.46(PB0) ; port ITEC1
JRST: IC9.134(PB4(NJTRST))
NRST: IC9.129(PG14) ; port PHY_NRST
OVERTHERMn: IC9.77(PD8) ; port OVERTHERMn
PC13: IC9.7(PC13) W2.9
PF11: IC9.49(PF11) W2.1
PF12: IC9.50(PF12) W2.2
PF13: IC9.53(PF13) W2.4
POE_PWR_SRC: IC9.54(PF14) ; port POE_PWR_SRC
PWM_maxINeg0: IC9.66(PE13) ; port PWM_maxINeg0
PWM_maxINeg1: IC9.67(PE14) ; port PWM_maxINeg1
PWM_maxIPos0: IC9.60(PE9) ; port PWM_maxIPos0
PWM_maxIPos1: IC9.64(PE11) ; port PWM_maxIPos1
PWM_maxV0: IC9.96(PC6) ; port PWM_maxV0
PWM_maxV1: IC9.97(PC7) ; port PWM_maxV1
REF_GND: NT1.2 ; port REF_GND
RMII_CRS_DV: IC9.43(PA7) ; port RMII_CRS_DV
RMII_MDC: IC9.27(PC1) ; port RMII_MDC
RMII_MDIO: IC9.36(PA2) ; port RMII_MDIO
RMII_REF_CLK: IC9.35(PA1) ; port RMII_REF_CLK
RMII_RXD0: IC9.44(PC4) ; port RMII_RXD0
RMII_RXD1: IC9.45(PC5) ; port RMII_RXD1
RMII_TX_EN: IC9.70(PB11) ; port RMII_TX_EN
RMII_TXD0: IC9.128(PG13) ; port RMII_TXD0
RMII_TXD1: IC9.74(PB13) ; port RMII_TXD1
RST: D5.2(A) IC9.25(NRST) J12.10 R62.2
RXD: IC9.137(PB7) W1.2
SCL0: IC9.11(PF1)
SCL1: IC9.100(PA8)
SDA0: IC9.10(PF0)
SPI3_MISO: IC9.112(PC11) W2.7
SPI3_MOSI: IC9.113(PC12) W2.8
SPI3_SCK: IC9.111(PC10) W2.6
STAT1R: IC9.78(PD9) ; port STAT1R
STAT3G: IC9.79(PD10) ; port STAT3G
STAT4G: IC9.80(PD11) ; port STAT4G
SWCLK: D2.3(I/O2) IC9.109(PA14(JTCK-SWCLK)) J12.4
SWDIO: D2.1(I/O1) IC9.105(PA13(JTMS-SWDIO)) J12.2
SYNC: IC9.82(PD13) ; port SYNC
TACHO: IC9.98(PC8) ; port TACHO
TDI: D2.4(I/O3) IC9.110(PA15(JTDI)) J12.8 R33.2
TDO: D2.6(I/O4) IC9.133(PB3(JTDO/TRACESWO)) J12.6
TXD: IC9.136(PB6) W1.3
USB_ID: IC9.102(PA10) ; port USB_ID
USB_N: IC9.103(PA11) ; port USB_N
USB_P: IC9.104(PA12) ; port USB_P
USB_VBUS: R34.2 ; port VBUS_DET
Vref0: IC9.34(PA0-WKUP(PA0)) ; port Vref0
Vref1: IC9.37(PA3) ; port Vref1
NetC17_2: C17.2 IC9.106(VCAP_2)
NetC18_2: C18.2 IC9.71(VCAP_1)
NetC21_1: C21.1 IC9.23(PH0-OSC_IN(PH0)) Q1.1(OSC1)
NetC22_1: C22.1 IC9.24(PH1-OSC_OUT(PH1)) Q1.2(OSC2)
NetC23_2: C23.2 C28.2 IC9.33(VDDA) L5.1
NetC24_2: C24.2 C25.2 IC9.32(VREF+) R71.1
NetIC9_48: IC9.48(PB2-BOOT1(PB2)) R32.2
NetIC9_101: IC9.101(PA9) R34.1
NetIC9_138: IC9.138(BOOT0) JP2.2(E2) R63.1
NetIC10_1: IC10.1(IN+) R87.1 R88.2

Not connected (* = marked no-connect by the designer): IC9 2(PE3) 4(PE5) 6(VBAT) 8(PC14-OSC32_IN(PC14)) 9(PC15-OSC32_OUT(PC15)) 12(PF2) 13(PF3) 14(PF4) 15(PF5) 22(PF10) 55(PF15) 56(PG0) 57(PG1) 85(PD14) 86(PD15) 87(PG2) 88(PG3) 89(PG4) 90(PG5) 91(PG6) 92(PG7) 93(PG8) 118(PD4) 119(PD5) 122(PD6) 123(PD7) 124(PG9) 125(PG10) 126(PG11) 127(PG12) 132(PG15) 135(PB5) 141(PE0) 142(PE1) 143(PDR_ON)*; IC12 5(NC)*; IC19 7(NC)*; J12 7 9

### Notes on the sheet
- (near R32) BOOT1
- (near C92) 2.28V
- (near C93) 2.02V
- TIM8 CH3 IC
- TIM8 CH4 PWM
- (near J12) SWD Programmer / debugger
- Project/Equipment
- Document
- Designer
- Drawn by
- Check.by
- Copyright WUT ISE 2020.
  This documentation describes Open Hardware and is licensed under the CERN OHL v.1.2. You may redistribute and modify this documentation under the terms of the CERN OHL v.1.2. (http://ohwr.org/CERNOHL). This documentation is distributed WITHOUT ANY EXPRESS OR IMPLIED WARRANTY, INCLUDING OF MERCHANTABILITY, SATISFACTORY QUALITY AND FITNESS FOR A PARTICULAR PURPOSE. Please see the CERN OHL v.1.2 for applicable conditions.
- Contact
- File
- Last Mod.
- Print Date
- Sheet
- Size
- A3
- of
- Rev
- (in symbol R0402_1K6_1%_0.0625W_100PPM) 1%
- (in symbol R0402_2K2_1%_0.0625W_100PPM) 1%
- (in symbol R0402_2k4_1%_0.0625W_100PPM) 1%
- (in symbol R0402_6K8_1%_0.0625W_100PPM) 1%
- (in symbol R0402_10K_1%_0.0625W_100PPM) 1%
- (in symbol R0402_51R_1%_0.0625W_100PPM) 1%

### Library data of the parts
B14 B15 = SMD_PAD_D1MM: as B1 on sheet Thermostat; Part Number: SMD_PAD_D1MM; Component Type: Standard (No BOM); Pin Count: 1; Family: SMD Pad; Socket: No; SMD: No; Sense: No; Status: None; ComponentHeight: 0mm; HelpURL: Undefined; Author: CERN DEM JLC; CreateDate: 10.10.2017; LatestRevisionDate: 10.10.2017; PackageDescription: 1mm Diameter SMD Pad
C17 C18 = CC0603_2.2UF_10V_20%_X7R: Non-polarised capacitor; Part Description: SMD Multilayer Chip Ceramic Capacitor; Manufacturer: GENERIC; Manufacturer1 Part Number: LMK107B7225MA-T; Voltage: 10V; TC: X7R; Tolerance: ±20%; Part Number: CC0603_2.2UF_10V_20%_X7R; Component Kind: Standard; Component Type: Standard; Pin Count: 2; Value: 2.2uF; Status: Not Recommended; Manufacturer Part Number: CC0603_2.2UF_10V_20%_X7R; Case: 0603; Mounted: Yes; Socket: No; SMD: Yes; Sense: No; Manufacturer1 Example: TAIYO YUDEN; Manufacturer1 ComponentHeight: 0.9mm; HelpURL: \\cern.ch\dfs\Applications\Altium\Datasheets\CC0603_X7R_TAIYO-YUDEN_HIGH-VALUE.pdf; Author: CERN DEM JLC; CreateDate: 22.06.2011; LatestRevisionDate: 27.06.2011
C21 C22 = CC0402_12PF_50V_5%_C0G: Non-polarised capacitor; Part Description: SMD Multilayer Chip Ceramic Capacitor; Manufacturer: GENERIC; Manufacturer1 Part Number: C0402C120J5GACTU; Voltage: 50V; TC: C0G/NP0; Tolerance: ±5%; Part Number: CC0402_12PF_50V_5%_C0G; Component Kind: Standard; Component Type: Standard; Pin Count: 2; Value: 12pF; Status: Preferred; Manufacturer Part Number: CC0402_12PF_50V_5%_C0G; Case: 0402; Mounted: Yes; Socket: No; SMD: Yes; Sense: No; Manufacturer1 Example: KEMET; Manufacturer1 ComponentHeight: 0.55mm; HelpURL: \\cern.ch\dfs\Applications\Altium\Datasheets\CC0805_C0G_KEMET_(Commercial Grade).pdf; Author: CERN DEM JLC; CreateDate: 04.10.2016; LatestRevisionDate: 04.10.2016
C23 C24 = CC0402_10NF_50V_10%_X7R: Non-polarised capacitor; Part Description: SMD Multilayer Chip Ceramic Capacitor; Manufacturer: GENERIC; Manufacturer1 Part Number: GRM155R71H103KA88D; Voltage: 50V; TC: X7R; Tolerance: ±10%; Part Number: CC0402_10NF_50V_10%_X7R; Component Kind: Standard; Component Type: Standard; Pin Count: 2; Value: 10nF; Status: None; Manufacturer Part Number: CC0402_10NF_50V_10%_X7R; Case: 0402; Mounted: Yes; Socket: No; SMD: Yes; Sense: No; Manufacturer1 Example: MURATA; Manufacturer1 ComponentHeight: 0.55mm; HelpURL: \\cern.ch\dfs\Applications\Altium\Datasheets\CC0402_X7R_MURATA_GRM.pdf; Author: CERN DEM MR; CreateDate: 08.01.2016; LatestRevisionDate: 08.01.2016
C25 C26 C28 = CC0603_1UF_25V_10%_X7R: as C101 on sheet Thermostat; Part Number: CC0603_1UF_25V_10%_X7R; Component Kind: Standard; Component Type: Standard; Pin Count: 2; Value: 1uF; Status: None; Manufacturer Part Number: CC0603_1UF_25V_10%_X7R; Case: 0603; Mounted: Yes; Socket: No; SMD: Yes; Sense: No; Manufacturer1 Example: MURATA; Manufacturer1 ComponentHeight: 0.9mm; HelpURL: \\cern.ch\dfs\Applications\Altium\Datasheets\CC0603_X7R_MURATA.pdf; Author: CERN DEM JLC; CreateDate: 18/01/2011; LatestRevisionDate: 18/01/2011
C29-C33 C94-C98 = CC0402_100NF_16V_10%_X7R: Non-polarised capacitor; Part Description: SMD Multilayer Chip Ceramic Capacitor; Manufacturer: GENERIC; Manufacturer1 Part Number: GRM155R71C104KA88D; Voltage: 16V; TC: X7R; Tolerance: ±10%; Part Number: CC0402_100NF_16V_10%_X7R; Component Kind: Standard; Component Type: Standard; Pin Count: 2; Value: 100nF; Status: Not Recommended; Manufacturer Part Number: CC0402_100NF_16V_10%_X7R; Case: 0402; Mounted: Yes; Socket: No; SMD: Yes; Manufacturer1 Example: MURATA; Manufacturer1 ComponentHeight: 0.55mm; HelpURL: \\cern.ch\dfs\Applications\Altium\Datasheets\CC0402_X7R_MURATA_GRM.pdf; Author: CERN DEM JLC; CreateDate: 05.12.2013; LatestRevisionDate: 03.12.2007; Sense: No
C35 C99 = CC0805_10UF_16V_10%_X5R: Non-polarised capacitor; Part Description: SMD Multilayer Chip Ceramic Capacitor; Manufacturer: GENERIC; Manufacturer1 Part Number: C0805C106K4PAC; Voltage: 16V; TC: X5R; Tolerance: ±10%; Part Number: CC0805_10UF_16V_10%_X5R; Component Kind: Standard; Component Type: Standard; Pin Count: 2; Value: 10uF; Status: Preferred; Manufacturer Part Number: CC0805_10UF_16V_10%_X5R; Case: 0805; Mounted: Yes; Socket: No; SMD: Yes; Manufacturer1 Example: KEMET; Manufacturer1 ComponentHeight: 1.4mm; HelpURL: \\cern.ch\dfs\Applications\Altium\Datasheets\CC1206_X5R_KEMET.pdf; Author: CERN DEM JLC; CreateDate: 03.12.2007; LatestRevisionDate: 03.12.2007; Sense: No
C92 C93 = CC0402_100NF_16V_10%_X5R: Non-polarised capacitor; Part Description: SMD Multilayer Chip Ceramic Capacitor; Manufacturer: GENERIC; Manufacturer1 Part Number: GRM155R61C104KA88D; Voltage: 16V; TC: X5R; Tolerance: ±10%; Table: Capacitors SMD; Part Number: CC0402_100NF_16V_10%_X5R; Component Kind: Standard; Component Type: Standard; Pin Count: 2; Value: 100nF; Status: None; Manufacturer Part Number: CC0402_100NF_16V_10%_X5R; Case: 0402; Mounted: Yes; Socket: No; SMD: Yes; Manufacturer1 Example: MURATA; Manufacturer1 ComponentHeight: 0.55mm; HelpURL: \\cern.ch\dfs\Applications\Altium\Datasheets\CC0402_X5R_MURATA_GRM.pdf; Author: CERN DEM JLC; CreateDate: 2013-12-10; LatestRevisionDate: 2013-12-10
D2 = D_TVS_DRTR5V0U4S-7: Integrated Quad Ultra-Low Capacitance ESD Protection; Part Description: Integrated Quad Ultra-Low Capacitance ESD (±8kV) Protection; Manufacturer: DIODES; PressFit: No; Bonding: No; Status Comment: Active; Part Number: DRTR5V0U4S-7; Component Kind: Standard; Component Type: Standard; Device: DRTR5V0U4S-7; PackageDescription: SOT363, SC70-6, 0.65mm Pitch; 6 Pin, 1.25mm W X 2.00mm L X 1.10mm H body, IPC Medium Density; Status: Active; Manufacturer Part Number: DRTR5V0U4S-7; Pin Count: 6; Case: SOT363; Mounted: Yes; Socket: No; SMD: Yes; Sense: No; ComponentHeight: 1.1mm; HelpURL: \\cern.ch\dfs\Applications\Altium\Datasheets\PRTR5V0U4Y.pdf; Author: GK; CreateDate: 24.01.2017; LatestRevisionDate: 14.09.2020
D5 = BAT165: as D24 on sheet Thermostat; Part Number: BAT165; Component Kind: Standard; Component Type: Standard; Device: BAT165; PackageDescription: Small Outline Diode Flat Lead (SOD-323), 1.70mm W X 1.25mm L X 1.10mm H body,  IPC Medium Density; Manufacturer Part Number: BAT165; Pin Count: 2; Case: SOD323; Mounted: Yes; Socket: No; SMD: Yes; Sense: No; ComponentHeight: 1.1mm; HelpURL: \\cern.ch\dfs\Applications\Altium\Datasheets\BAT165.pdf; Author: CERN DEM JLC; CreateDate: 12.11.2014; LatestRevisionDate: 12.11.2014
IC9 = CMP-0243-00053-2: ARM Cortex-M4 32-bit MCU+FPU, 210 DMIPS, 2048 kB Flash, 256 kB Internal RAM, 114 I/Os, 144-pin LQFP, -40 to 85 degC, Tray; Manufacturer: STMicroelectronics; I/Os (High Current): 114; Operating Frequency(F) (Processor speed) (MHz): 168; Supply Voltage(Vcc) max (V): 3.6; FLASH Size (Prog) (kB): 2048; Internal RAM Size (kB): 256; D/A Converter: 2x12-bit; Supply Voltage(Vcc) min (V): 1.8; PartNumber: STM32F427ZIT6; PackageReference: LQFP144; ComponentLink2Description: Datasheet; PackageVersion: Rev. 4, 06/2013; Core: ARM Cortex-M4; Mounting Technology: Surface Mount; ComponentLink3Description: Package Specification; PackageDescription: 144-Pin Low Profile Quad Flat Package, 20 x 20 mm Body, 0.5 mm Pitch; ComponentLink1Description: Manufacturer URL; ComponentLink2URL: http://www.st.com/st-web-ui/static/active/en/resource/technical/document/datasheet/DM00071990.pdf; ComponentLink3URL: http://www.st.com/st-web-ui/static/active/en/resource/technical/document/datasheet/DM00037051.pdf; Packing: Tray; ComponentLink1URL: http://www.st.com/web/en/home.html; DatasheetVersion: Rev. 1
IC10 = LMV321ILT: Operational Amplifier; Part Description: Low Cost, Low Power, Input/Output Rail-To-Rail Operational Amplifiers; Manufacturer: ST MICROELECTRONICS; PressFit: No; Bonding: No; Part Number: LMV321ILT; Component Kind: Standard; Component Type: Standard; Device: LMV321ILT; PackageDescription: SOT, 0.95mm pitch; 5 pin, 1.60mm W X 2.90mm L X 1.45mm H body, IPC Medium Density; Manufacturer Part Number: LMV321ILT; Pin Count: 5; Case: SOT23-5; Mounted: Yes; Socket: No; SMD: Yes; Sense: No; ComponentHeight: 1.45mm; Author: CERN DEM MR; HelpURL: \\cern.ch\dfs\Applications\Altium\Datasheets\LMV321ILT.pdf; CreateDate: 02.10.2017; LatestRevisionDate: 02.10.2017
IC12 = 24AA02E48T-I/OT: 1.7V-5.5V, 2K I2C Serial EEPROM With EUI-48 Node Identity; Manufacturer: MICROCHIP TECHNOLOGY; PressFit: No; Bonding: No; Part Number: 24AA02E48T-I/OT; Component Kind: Standard; Component Type: Standard; Device: 24AA02E48T-I/OT; PackageDescription: SOT, 0.95mm pitch; 5 pin, 1.60mm W X 2.90mm L X 1.45mm H body, IPC Medium Density; Part Description: 1.7V-5.5V, 2K I2C Serial EEPROM With EUI-48 Node Identity; Manufacturer Part Number: 24AA02E48T-I/OT; Pin Count: 5; Case: SOT23-5; Mounted: Yes; Socket: No; SMD: Yes; Sense: No; ComponentHeight: 1.45mm; HelpURL: \\cern.ch\dfs\Applications\Altium\Datasheets\24AA02E48T-I-OT.pdf; Author: CERN DEM MR; CreateDate: 2016-03-31; LatestRevisionDate: 2016-03-31
IC13 = VMON_STM809: 2.93V  Reset circuit
IC19 = MEM_24AA02E48T-I/SN: 1.7V-5.5V, 2K I2C™ Serial EEPROMs with EUI-48™ Node Identity; Manufacturer: MICROCHIP TECHNOLOGY; PressFit: No; Bonding: No; Part Number: 24AA02E48T-I/SN; Component Kind: Standard; Component Type: Standard; Device: 24AA02E48T-I/SN; PackageDescription: SOIC 8, Pitch 1.27mm - Body 4x5mm, IPC Medium Density; Part Description: 1.7V-5.5V, 2K I2C™ Serial EEPROMs with EUI-48™ Node Identity; Manufacturer Part Number: 24AA02E48T-I/SN; Pin Count: 8; Case: SOIC8; Mounted: Yes; Socket: No; SMD: Yes; Sense: No; ComponentHeight: 1.75mm; HelpURL: \\cern.ch\dfs\Applications\Altium\Datasheets\24AA025E48-I-SN.pdf; Author: GK; CreateDate: 19.07.2016; LatestRevisionDate: 19.07.2016
J12 = CON_2x10 1.27 SMT_male_HARWIN: 10 Contacts - Pitch 1.27mm - Dual Row SMT Vertical Pin Header (Post Lead = 3mm, Insulator 1mm); Manufacturer: HARWIN; PressFit: No; Part Number: HARWIN_M50-3600542; Component Kind: Standard; Component Type: Standard; Pin Count: 10; Family: Header 10; Mounted: Yes; Socket: No; SMD: Yes; Sense: No; Status: None; Part Description: 10 Contacts - Pitch 1.27mm - Dual Row SMT Vertical Pin Header (Post Lead = 3mm, Insulator 1mm); ComponentHeight: 5.13mm; HelpURL: \\cern.ch\dfs\Applications\Altium\Datasheets\HARWIN_M50-3600842.pdf; Author: GK; CreateDate: 15.03.2017; LatestRevisionDate: 22.05.2017
JP2 = JUMPER: Supplier 1: Farnell; Supplier Part Number 1: 1798942
L5 = IND0402_MURATA_BLM15HB221SN1: Part Description: SMD EMIFIL Suppression Chip Ferrite Bead; Manufacturer: MURATA; Power: 250mA; Resistance: 1R; Tolerance: ±25%; Part Number: IND0402_MURATA_BLM15HB221SN1; Component Kind: Standard; Component Type: Standard; Pin Count: 2; Value: 220R@100MHz; Status: None; Manufacturer Part Number: BLM15HB221SN1; Case: 0402; Mounted: Yes; Socket: No; SMD: Yes; Sense: No; ComponentHeight: 0.55mm; HelpURL: \\cern.ch\dfs\Applications\Altium\Datasheets\IND0402_MURATA_BLM15H.pdf; Author: CERN DEM JLC; CreateDate: 23.06.2009; LatestRevisionDate: 25.10.2018
NT1 = Net Tie: Part Description: Net Tie (2 Nets); Mounted: No; Part Number: Net Tie; Component Type: Net Tie; Pin Count: 2; Family: Net Tie; Socket: No; SMD: No; Sense: No; Status: None; ComponentHeight: 0mm; HelpURL: Undefined; Author: CERN DEM JLC; CreateDate: 22.03.2011; LatestRevisionDate: 22.03.2011; PackageDescription: 2 Plated Through Hole For Coaxial Cable Link: Hole Dia.=1.4mm Pad Dia.=2.5mm
Q1 = XTAL_8MHZ_TXC_7A-8.000MAAE-T: Quartz Crystal; Part Description: Tolerance: ±30ppm, Stability: ±30ppm, -20°C to +70°C, 12pF, SMD Glass Seam Sealing Crystal, 7A Series; Manufacturer: TXC CORPORATION; PressFit: No; Bonding: No; Part Number: XTAL_8MHZ_TXC_7A-8.000MAAE-T; Component Kind: Standard; Component Type: Standard; PackageDescription: 2 Pins, 3.2x5mm, SMD Glass Seam Sealing Crystal, 7A Serie; Value: 8MHz; Manufacturer Part Number: 7A-8.000MAAE-T; Pin Count: 2; Mounted: Yes; Socket: No; SMD: Yes; Sense: No; ComponentHeight: 1.2mm; HelpURL: \\cern.ch\dfs\Applications\Altium\Datasheets\XTAL_TXC_7A.pdf; Author: CERN DEM JLC; CreateDate: 09.10.2014; LatestRevisionDate: 12.11.2014
R32-R34 R53 R61-R63 R82 = R0402_10K_1%_0.0625W_100PPM: Resistor - 1%; Part Description: General Purpose Thick Film Chip Resistor; Manufacturer: GENERIC; Manufacturer1 Part Number: 232270671003L; TC: ±100ppm/°C; Table: Resistors SMD; Part Number: R0402_10K_1%_0.0625W_100PPM; Component Kind: Standard; Component Type: Standard; Pin Count: 2; Value: 10k; Status: Not recommended; Power: 0.0625W; Tolerance: ±1%; Manufacturer Part Number: R0402_10K_1%_0.0625W_100PPM; Case: 0402; Mounted: Yes; Socket: No; SMD: Yes; Manufacturer1 Example: YAGEO PHYCOMP; Manufacturer1 ComponentHeight: 0.4mm; HelpURL: \\cern.ch\dfs\Applications\Altium\Datasheets\R0402_Phycomp_RC0402.pdf; Author: CERN DEM JLC; CreateDate: 2007-12-03; LatestRevisionDate: 2012-10-17
R71 = R0402_51R_1%_0.0625W_100PPM: Resistor - 1%; Part Description: General Purpose Thick Film Chip Resistor; Manufacturer: GENERIC; Manufacturer1 Part Number: 232270675109L; TC: ±100ppm/°C; PressFit: No; Part Number: R0402_51R_1%_0.0625W_100PPM; Component Kind: Standard; Component Type: Standard; Pin Count: 2; Value: 51; Status: Not Recommended; Power: 0.0625W; Tolerance: ±1%; Manufacturer Part Number: R0402_51R_1%_0.0625W_100PPM; Case: 0402; Mounted: Yes; Sense: No; Socket: No; SMD: Yes; Manufacturer1 Example: YAGEO PHYCOMP; Manufacturer1 ComponentHeight: 0.4mm; HelpURL: \\cern.ch\dfs\Applications\Altium\Datasheets\R0402_Phycomp_RC0402.pdf; Author: CERN DEM JLC; CreateDate: 03/12/2007; LatestRevisionDate: 17/10/2012
R81 R87 = R0402_1K6_1%_0.0625W_100PPM: Resistor - 1%; Part Description: General Purpose Thick Film Chip Resistor; Manufacturer: GENERIC; Manufacturer1 Part Number: 232270671602L; TC: ±100ppm/°C; PressFit: No; Part Number: R0402_1K6_1%_0.0625W_100PPM; Component Kind: Standard; Component Type: Standard; Pin Count: 2; Value: 1k6; Status: Not Recommended; Power: 0.0625W; Tolerance: ±1%; Manufacturer Part Number: R0402_1K6_1%_0.0625W_100PPM; Case: 0402; Mounted: Yes; Sense: No; Socket: No; SMD: Yes; Manufacturer1 Example: YAGEO PHYCOMP; Manufacturer1 ComponentHeight: 0.4mm; HelpURL: \\cern.ch\dfs\Applications\Altium\Datasheets\R0402_Phycomp_RC0402.pdf; Author: CERN DEM JLC; CreateDate: 03.12.2007; LatestRevisionDate: 17.10.2012
R83 R84 = R0402_6K8_1%_0.0625W_100PPM: Resistor - 1%; Part Description: General Purpose Thick Film Chip Resistor; Manufacturer: GENERIC; Manufacturer1 Part Number: 232270676802L; TC: ±100ppm/°C; PressFit: No; Part Number: R0402_6K8_1%_0.0625W_100PPM; Component Kind: Standard; Component Type: Standard; Pin Count: 2; Value: 6k8; Status: Not Recommended; Power: 0.0625W; Tolerance: ±1%; Manufacturer Part Number: R0402_6K8_1%_0.0625W_100PPM; Case: 0402; Mounted: Yes; Sense: No; Socket: No; SMD: Yes; Manufacturer1 Example: YAGEO PHYCOMP; Manufacturer1 ComponentHeight: 0.4mm; HelpURL: \\cern.ch\dfs\Applications\Altium\Datasheets\R0402_Phycomp_RC0402.pdf; Author: CERN DEM JLC; CreateDate: 03.12.2007; LatestRevisionDate: 17.10.2012
R88 = R0402_2k4_1%_0.0625W_100PPM: Resistor - 1%; Part Description: General Purpose Thick Film Chip Resistor; Manufacturer: GENERIC; Manufacturer1 Part Number: 232270672402L; TC: ±100ppm/°C; PressFit: No; Part Number: R0402_2K4_1%_0.0625W_100PPM; Component Kind: Standard; Component Type: Standard; Pin Count: 2; Value: 2k4; Status: Not Recommended; Power: 0.0625W; Tolerance: ±1%; Manufacturer Part Number: R0402_2K4_1%_0.0625W_100PPM; Case: 0402; Mounted: Yes; Sense: No; Socket: No; SMD: Yes; Manufacturer1 Example: YAGEO PHYCOMP; Manufacturer1 ComponentHeight: 0.4mm; HelpURL: \\cern.ch\dfs\Applications\Altium\Datasheets\R0402_Phycomp_RC0402.pdf; Author: CERN DEM JLC; CreateDate: 03.12.2007; LatestRevisionDate: 17.10.2012
R106 R119-R121 = R0402_2K2_1%_0.0625W_100PPM: Resistor - 1%; Part Description: General Purpose Thick Film Chip Resistor; Manufacturer: GENERIC; Manufacturer1 Part Number: 232270672202L; TC: ±100ppm/°C; Part Number: R0402_2K2_1%_0.0625W_100PPM; Component Kind: Standard; Component Type: Standard; Pin Count: 2; Value: 2k2; Status: Not recommended; Power: 0.0625W; Tolerance: ±1%; Manufacturer Part Number: R0402_2K2_1%_0.0625W_100PPM; Case: 0402; Mounted: Yes; Sense: No; Socket: No; SMD: Yes; Manufacturer1 Example: YAGEO PHYCOMP; Manufacturer1 ComponentHeight: 0.4mm; HelpURL: \\cern.ch\dfs\Applications\Altium\Datasheets\R0402_Phycomp_RC0402.pdf; Author: CERN DEM JLC; CreateDate: 03.12.2007; LatestRevisionDate: 17.10.2012
W1 = SAMTEC_HTSW-104-23-L-S: 4 Mini Wire-Wrap Contact Strip Header; Part Description: 4 Contacts, Pitch 2.54mm, Single Row  Through Mount Straight Header (Post Lead 5.84mm, Tail Lead 2.92mm, Insulator 2.54mm); Manufacturer: SAMTEC; PressFit: No; Status Comment: High Temperature; Part Number: SAMTEC_HTSW-104-23-L-S; Component Kind: Standard; Component Type: Standard; Pin Count: 4; Family: Header 4; Mounted: Yes; Socket: No; Sense: No; SMD: No; Status: Preferred; Manufacturer Part Number: HTSW-104-23-L-S; ComponentHeight: 8.38mm; HelpURL: \\cern.ch\dfs\Applications\Altium\Datasheets\SAMTEC_HTSW-104-23-L-S.pdf; Author: CERN DEM JLC; CreateDate: 22/02/2018; LatestRevisionDate: 22/02/2018
W2 = SAMTEC_MTLW-110-07-L-S-250: 10 Mini Wire-Wrap Contact Strip Header; Part Description: 10 Contacts, Pitch 2.54mm, Single Row Through Mount Straight Header (Post Lead = 6.35mm, Tail Lead 3.05mm, Insulator 1.52mm); Manufacturer: SAMTEC; PressFit: No; Part Number: SAMTEC_MTLW-110-07-L-S-250; Component Kind: Standard; Component Type: Standard; Pin Count: 10; Family: Header 10; Mounted: Yes; Socket: No; Sense: No; SMD: No; Status: None; Manufacturer Part Number: MTLW-110-07-L-S-250; ComponentHeight: 7.87mm; HelpURL: \\cern.ch\dfs\Applications\Altium\Datasheets\SAMTEC_MTLW-110-07-L-S-250.pdf; Author: CERN DEM JLC; CreateDate: 01.11.2017; LatestRevisionDate: 01.11.2017